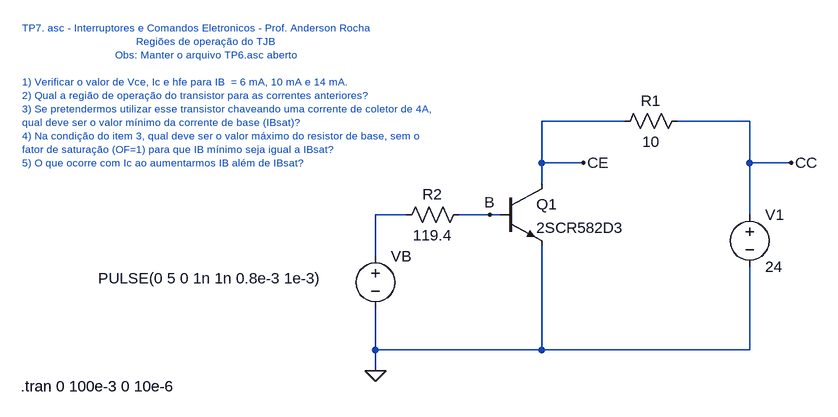
[diagram p0: schematic questao_3.asc]
questao_3.asc, the LTspice schematic file:
Version 4
SHEET 1 1012 680
WIRE 576 0 448 0
WIRE 768 0 656 0
WIRE 448 64 448 0
WIRE 512 64 448 64
WIRE 768 64 768 0
WIRE 832 64 768 64
WIRE 448 96 448 64
WIRE 240 144 192 144
WIRE 368 144 320 144
WIRE 384 144 368 144
WIRE 768 144 768 64
WIRE 192 208 192 144
WIRE 192 352 192 288
WIRE 448 352 448 192
WIRE 448 352 192 352
WIRE 768 352 768 224
WIRE 768 352 448 352
WIRE 192 384 192 352
FLAG 192 384 0
FLAG 368 144 B
FLAG 512 64 CE
FLAG 832 64 CC
SYMBOL res 672 -16 R90
WINDOW 0 0 56 VBottom 2
WINDOW 3 32 56 VTop 2
SYMATTR InstName R1
SYMATTR Value 10
SYMBOL npn 384 96 R0
SYMATTR InstName Q1
SYMATTR Value 2SCR582D3
SYMBOL voltage 768 128 R0
WINDOW 123 0 0 Left 0
WINDOW 39 0 0 Left 0
SYMATTR InstName V1
SYMATTR Value 24
SYMBOL voltage 192 192 R0
WINDOW 123 0 0 Left 0
WINDOW 39 0 0 Left 0
WINDOW 3 -427 50 Left 2
SYMATTR InstName VB
SYMATTR Value PULSE(0 5 0 1n 1n 0.8e-3 1e-3)
SYMBOL res 336 128 R90
WINDOW 0 0 56 VBottom 2
WINDOW 3 32 56 VTop 2
SYMATTR InstName R2
SYMATTR Value 119.4
TEXT -352 -144 Left 1 ;TP7. asc - Interruptores e Comandos Eletronicos - Prof. Anderson Rocha\n                                      Regiões de operação do TJB\n                               Obs: Manter o arquivo TP6.asc aberto\n \n1) Verificar o valor de Vce, Ic e hfe para IB  = 6 mA, 10 mA e 14 mA.\n2) Qual a região de operação do transistor para as correntes anteriores?\n3) Se pretendermos utilizar esse transistor chaveando uma corrente de coletor de 4A, \nqual deve ser o valor mínimo da corrente de base (IBsat)?\n4) Na condição do item 3, qual deve ser o valor máximo do resistor de base, sem o \nfator de saturação (OF=1) para que IB mínimo seja igual a IBsat?\n5) O que ocorre com Ic ao aumentarmos IB além de IBsat?
TEXT -354 408 Left 2 !.tran 0 100e-3 0 10e-6

The netlist it stands for:
* questao_3.asc
R1 CC CE 10
Q1 CE B 0 0 2SCR582D3
V1 CC 0 24
VB N001 0 PULSE(0 5 0 1n 1n 0.8e-3 1e-3)
R2 B N001 119.4
.model NPN NPN
.model PNP PNP
.lib standard.bjt
* TP7. asc - Interruptores e Comandos Eletronicos - Prof. Anderson Rocha
*                                       Regiões de operação do TJB
*                                Obs: Manter o arquivo TP6.asc aberto
* 1) Verificar o valor de Vce, Ic e hfe para IB  = 6 mA, 10 mA e 14 mA.
* 2) Qual a região de operação do transistor para as correntes anteriores?
* 3) Se pretendermos utilizar esse transistor chaveando uma corrente de coletor de 4A,
* qual deve ser o valor mínimo da corrente de base (IBsat)?
* 4) Na condição do item 3, qual deve ser o valor máximo do resistor de base, sem o
* fator de saturação (OF=1) para que IB mínimo seja igual a IBsat?
* 5) O que ocorre com Ic ao aumentarmos IB além de IBsat?
.tran 0 100e-3 0 10e-6
.backanno
.end